# EAGLE design Breakout (EAGLE 6.5.0)
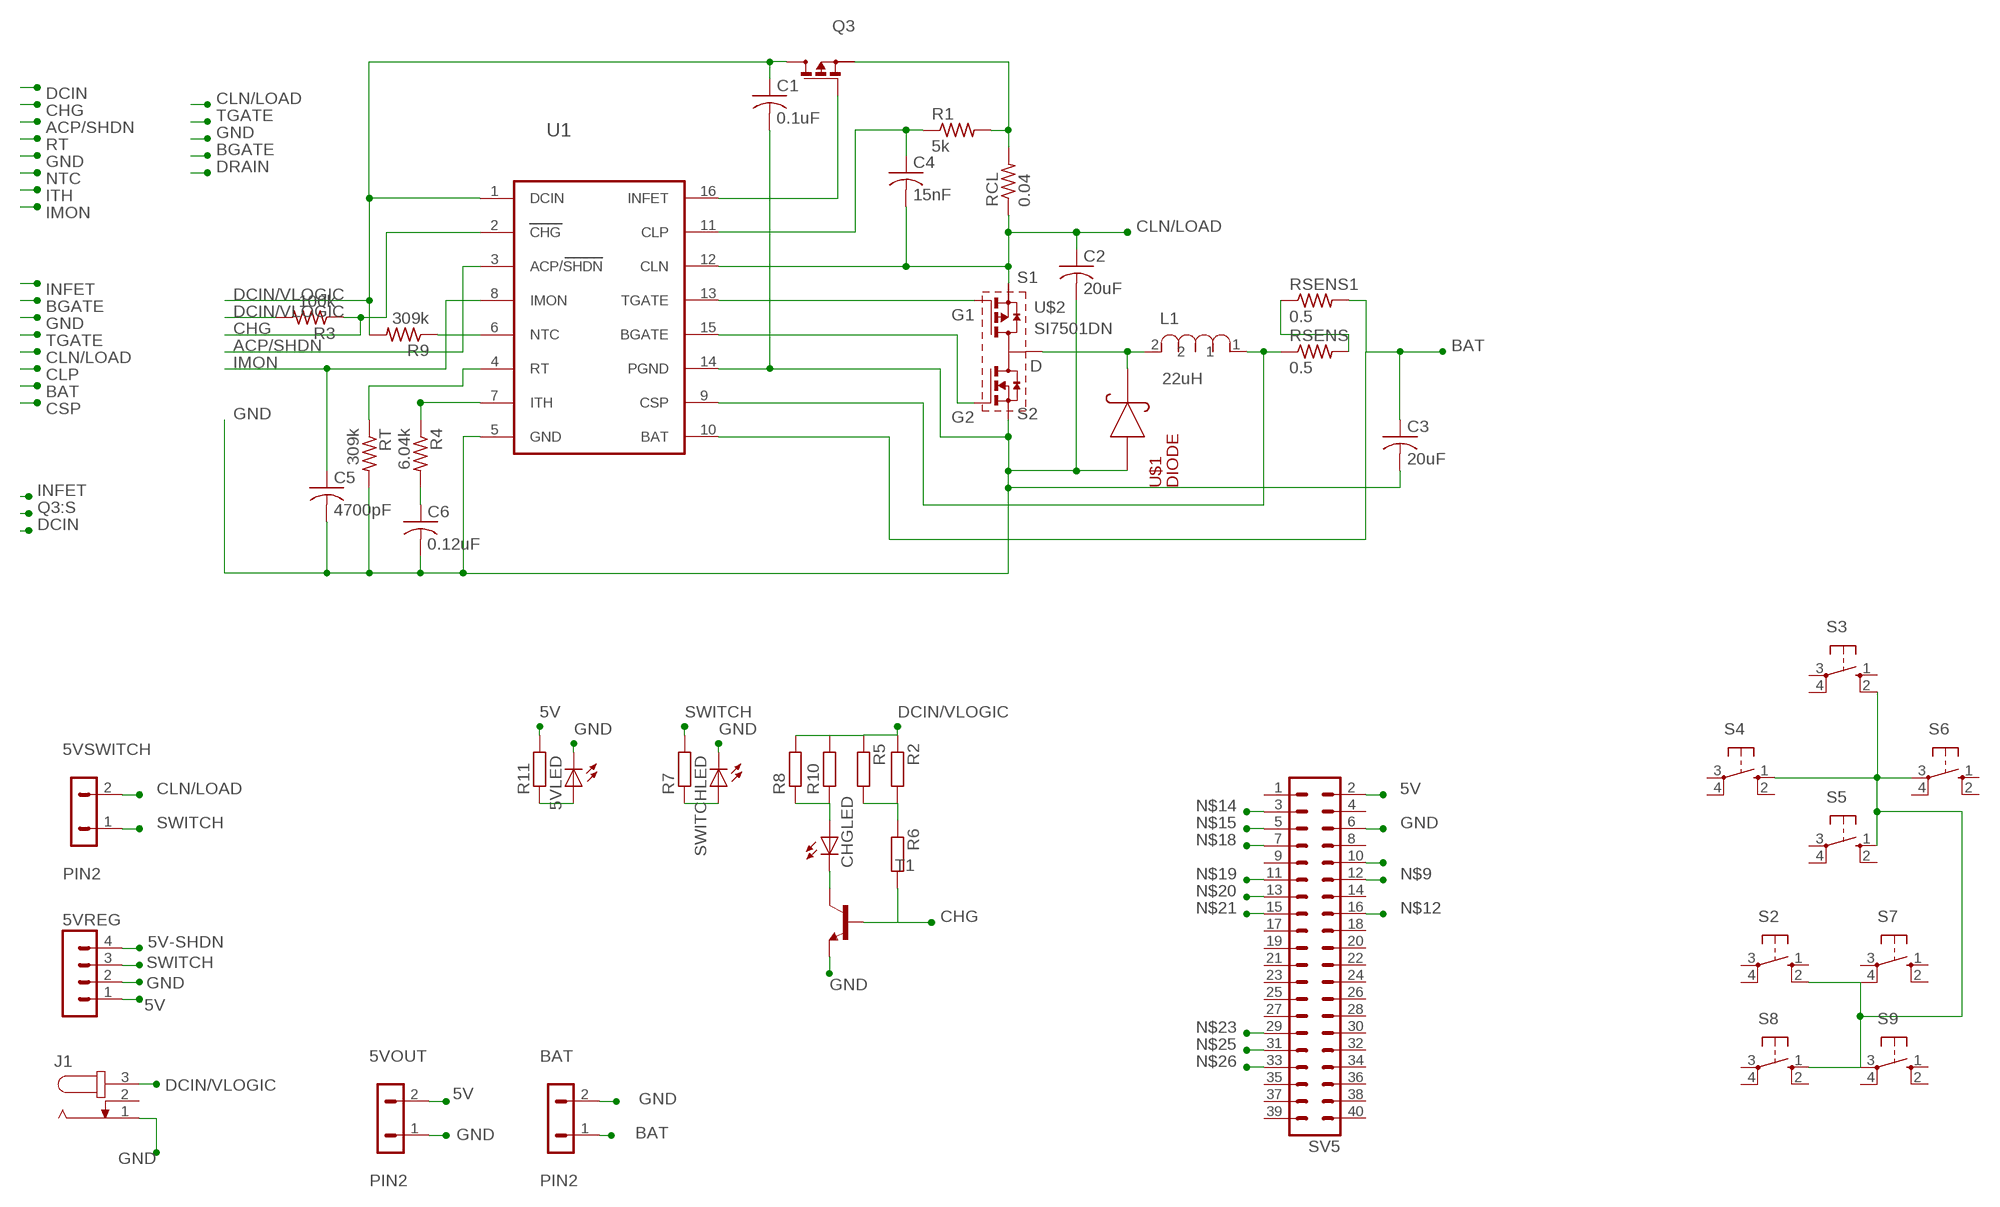
[diagram p0: schematic, sheet 1]

## Parts
5VLED  LED5MM  [LED5MM]
5VOUT  PIN2  [PIN2]
5VREG  MA04-1  [MA04-1]
5VSWITCH  PIN2  [PIN2]
BAT  PIN2  [PIN2]
C1  0.1uF  C-USC1210  [C1210]
C2  20uF  C-USC1210  [C1210]
C3  20uF  C-USC1210  [C1210]
C4  15nF  C-USC1210  [C1210]
C5  4700pF  C-USC1210  [C1210]
C6  0.12uF  C-USC1210  [C1210]
CHGLED  LED5MM  [LED5MM]
J1  JACK-PLUG0  [SPC4077]
L1  22uH  SDR1005INDUCTOR  [POWERINDUCTOR]
Q3  MOSFET  [SOT-23]
R1  5k  R-US_R1206  [R1206]
R2  R-EU_0207/7  [0207/7]
R3  100k  R-US_R1206  [R1206]
R4  6.04k  R-US_R1206  [R1206]
R5  R-EU_0207/7  [0207/7]
R6  R-EU_0207/7  [0207/7]
R7  R-EU_0207/7  [0207/7]
R8  R-EU_0207/7  [0207/7]
R9  309k  R-US_R1206  [R1206]
R10  R-EU_0207/7  [0207/7]
R11  R-EU_0207/7  [0207/7]
RCL  0.04  R-US_R1206  [R1206]
RSENS  0.5  0612/1632  [0612/1632]
RSENS1  0.5  0612/1632  [0612/1632]
RT  309k  R-US_R1206  [R1206]
S2  10-XX  [B3F-10XX]
S3  10-XX  [B3F-10XX]
S4  10-XX  [B3F-10XX]
S5  10-XX  [B3F-10XX]
S6  10-XX  [B3F-10XX]
S7  10-XX  [B3F-10XX]
S8  10-XX  [B3F-10XX]
S9  10-XX  [B3F-10XX]
SV5  MA20-2  [MA20-2]
SWITCHLED  LED5MM  [LED5MM]
T1  -NPN-TO92-E1  [TO92-E1]
U1  LTC6004  [SSOP-16]
U$1  DIODE  [DIODE]
U$2  SI7501DN  [POWERPAK]

## Nets
5V: 5VOUT.2 5VREG.1 R11.2 SV5.2
5V-SHDN: 5VREG.4
ACP/SHDN: U1.3(ACP/SHDN)
BAT: BAT.1 C3.1 RSENS1.2 U1.10(BAT)
BGATE: U1.15(BGATE) U$2.G2
CHG: R3.1 R6.2 T1.2(B) U1.2(CHG)
CLN/LOAD: 5VSWITCH.2 C2.1 C4.2 RCL.1 U1.12(CLN) U$2.S1
CLP: C4.1 R1.1 U1.11(CLP)
CSP: L1.1 RSENS.1 U1.9(CSP)
DCIN/VLOGIC: C1.1 J1.3 Q3.DRAIN(D) R2.1 R3.2 R5.1 R8.2 R9.2 R10.2 U1.1(DCIN)
DRAIN: L1.2 U$1.P$1 U$2.D
GND: 5VLED.K(C) 5VOUT.1 5VREG.2 BAT.2 C1.2 C2.2 C3.2 C5.2 C6.2 J1.1 RT.2 S2.2(S1) S3.2(S1) S4.1(S) S5.1(S) S6.3(P) S7.4(P1) S8.1(S) S9.3(P) SV5.6 SWITCHLED.K(C) T1.3(E) U1.5(GND) U1.14(PGND) U$1.P$2 U$2.S2
IMON: C5.1 U1.8(IMON)
INFET: Q3.GATE(G) U1.16(INFET)
ITH: R4.1 U1.7(ITH)
N$1: RSENS1.1 RSENS.2
N$6: R2.2 R5.2 R6.1
N$9: SV5.12
N$10: CHGLED.A R8.1 R10.1
N$11: C6.1 R4.2
N$12: SV5.16
N$13: R7.1 SWITCHLED.A
N$14: SV5.3
N$15: SV5.5
N$16: CHGLED.K(C) T1.1(C)
N$17: 5VLED.A R11.1
N$18: SV5.7
N$19: SV5.11
N$20: SV5.13
N$21: SV5.15
N$23: SV5.29
N$24: SV5.10
N$25: SV5.31
N$26: SV5.33
NTC: R9.1 U1.6(NTC)
Q3:S: Q3.SOURCE(S) R1.2 RCL.2
RT: RT.1 U1.4(RT)
SWITCH: 5VREG.3 5VSWITCH.1 R7.2
TGATE: U1.13(TGATE) U$2.G1
Unconnected: J1.2 S2.1(S) S2.3(P) S2.4(P1) S3.1(S) S3.3(P) S3.4(P1) S4.2(S1) S4.3(P) S4.4(P1) S5.2(S1) S5.3(P) S5.4(P1) S6.1(S) S6.2(S1) S6.4(P1) S7.1(S) S7.2(S1) S7.3(P) S8.2(S1) S8.3(P) S8.4(P1) S9.1(S) S9.2(S1) S9.4(P1) SV5.1 SV5.4 SV5.8 SV5.9 SV5.14 SV5.17 SV5.18 SV5.19 SV5.20 SV5.21 SV5.22 SV5.23 SV5.24 SV5.25 SV5.26 SV5.27 SV5.28 SV5.30 SV5.32 SV5.34 SV5.35 SV5.36 SV5.37 SV5.38 SV5.39 SV5.40

## Library data of the parts
5VLED CHGLED SWITCHLED = led:LED: LED OSRAM: - CHIPLED LG R971, LG N971, LY N971, LG Q971, LY Q971, LO R971, LY R971 LH N974, LH R974 LS Q976, LO Q976, LY Q976 LO Q996 - Hyper CHIPLED LW Q18S LB Q993, LB Q99A, LB R99A - SideLED LS A670, LO A670, LY A670, LG A670, LP A670 LB A673, LV A673, LT A673, LW A673 LH A674 LY A675 LS A676, LA A676, LO A676, LY A676, LW A676 LS A679, LY A679, LG A679 - Hyper Micro SIDELED® LS Y876, LA Y876, LO Y876, LY Y876 LT Y87S - SmartLED LW L88C, LW L88S LB L89C, LB L89S, LG L890 LS L89K, LO L89K, LY L89K LS L896, LA L896, LO L896, LY L896 - TOPLED LS T670, LO T670, LY T670, LG T670, LP T670 LSG T670, LSP T670, LSY T670, LOP T670, LYG T670 LG T671, LOG T671, LSG T671 LB T673, LV T673, LT T673, LW T673 LH T674 LS T676, LA T676, LO T676, LY T676, LB T676, LH T676, LSB T676, LW T676 LB T67C, LV T67C, LT T67C, LS T67K, LO T67K, LY T67K, LW E67C LS E67B, LA E67B, LO E67B, LY E67B, LB E67C, LV E67C, LT E67C LW T67C LS T679, LY T679, LG T679 LS T770, LO T770, LY T770, LG T770, LP T770 LB T773, LV T773, LT T773, LW T773 LH T774 LS E675, LA E675, LY E675, LS T675 LS T776, LA T776, LO T776, LY T776, LB T776 LHGB T686 LT T68C, LB T68C - Hyper Mini TOPLED® LB M676 - Mini TOPLED Santana® LG M470 LS M47K, LO M47K, LY M47K Source: http://www.osram.convergy.de LUXEON: - LUMILED® LXK2-PW12-R00, LXK2-PW12-S00, LXK2-PW14-U00, LXK2-PW14-V00 LXK2-PM12-R00, LXK2-PM12-S00, LXK2-PM14-U00 LXK2-PE12-Q00, LXK2-PE12-R00, LXK2-PE12-S00, LXK2-PE14-T00, LXK2-PE14-U00 LXK2-PB12-K00, LXK2-PB12-L00, LXK2-PB12-M00, LXK2-PB14-N00, LXK2-PB14-P00, LXK2-PB14-Q00 LXK2-PR12-L00, LXK2-PR12-M00, LXK2-PR14-Q00, LXK2-PR14-R00 LXK2-PD12-Q00, LXK2-PD12-R00, LXK2-PD12-S00 LXK2-PH12-R00, LXK2-PH12-S00 LXK2-PL12-P00, LXK2-PL12-Q00, LXK2-PL12-R00 Source: www.luxeon.com KINGBRIGHT: KA-3528ASYC Source: www.kingbright.com
5VOUT 5VSWITCH BAT = Custom:PIN2
5VREG = con-lstb:MA04-1: PIN HEADER; OC_FARNELL: unknown; OC_NEWARK: unknown
C1-C6 = resistor:C-US: CAPACITOR, American symbol
J1 = con-jack:JACK-PLUG: DC POWER JACK Power Jack, DC, Right Angle, Through Hole, Rated 5A at 16VDC, PC Terminals Distributor: Farnell (www.Farnell.de) Drawing: 84N1161.pdf / 84N1162.pdf Manufacturer: SPC Technology (www.spctechnology.com) Type: SPC4077 / SPC 4078; OC_FARNELL: unknown; OC_NEWARK: unknown
L1 = Custom:SDR1005INDUCTOR
Q3 = Custom:MOSFET
R1 R3 R4 R9 RCL RT = resistor:R-US_: RESISTOR, American symbol
R2 R5-R8 R10 R11 = resistor:R-EU_: RESISTOR, European symbol
RSENS RSENS1 = Custom:0612/1632
S2-S9 = switch-omron:10-XX: OMRON SWITCH; MPN: B3F-1000; OC_FARNELL: 176432; OC_NEWARK: 36M3542
SV5 = con-lstb:MA20-2: PIN HEADER; OC_FARNELL: unknown; OC_NEWARK: unknown
T1 = transistor:*-NPN-: NPN Transistror BF959 corrected 2008.03.06
U1 = Custom:LTC6004
U$1 = Custom:DIODE
U$2 = Custom:SI7501DN

## Board
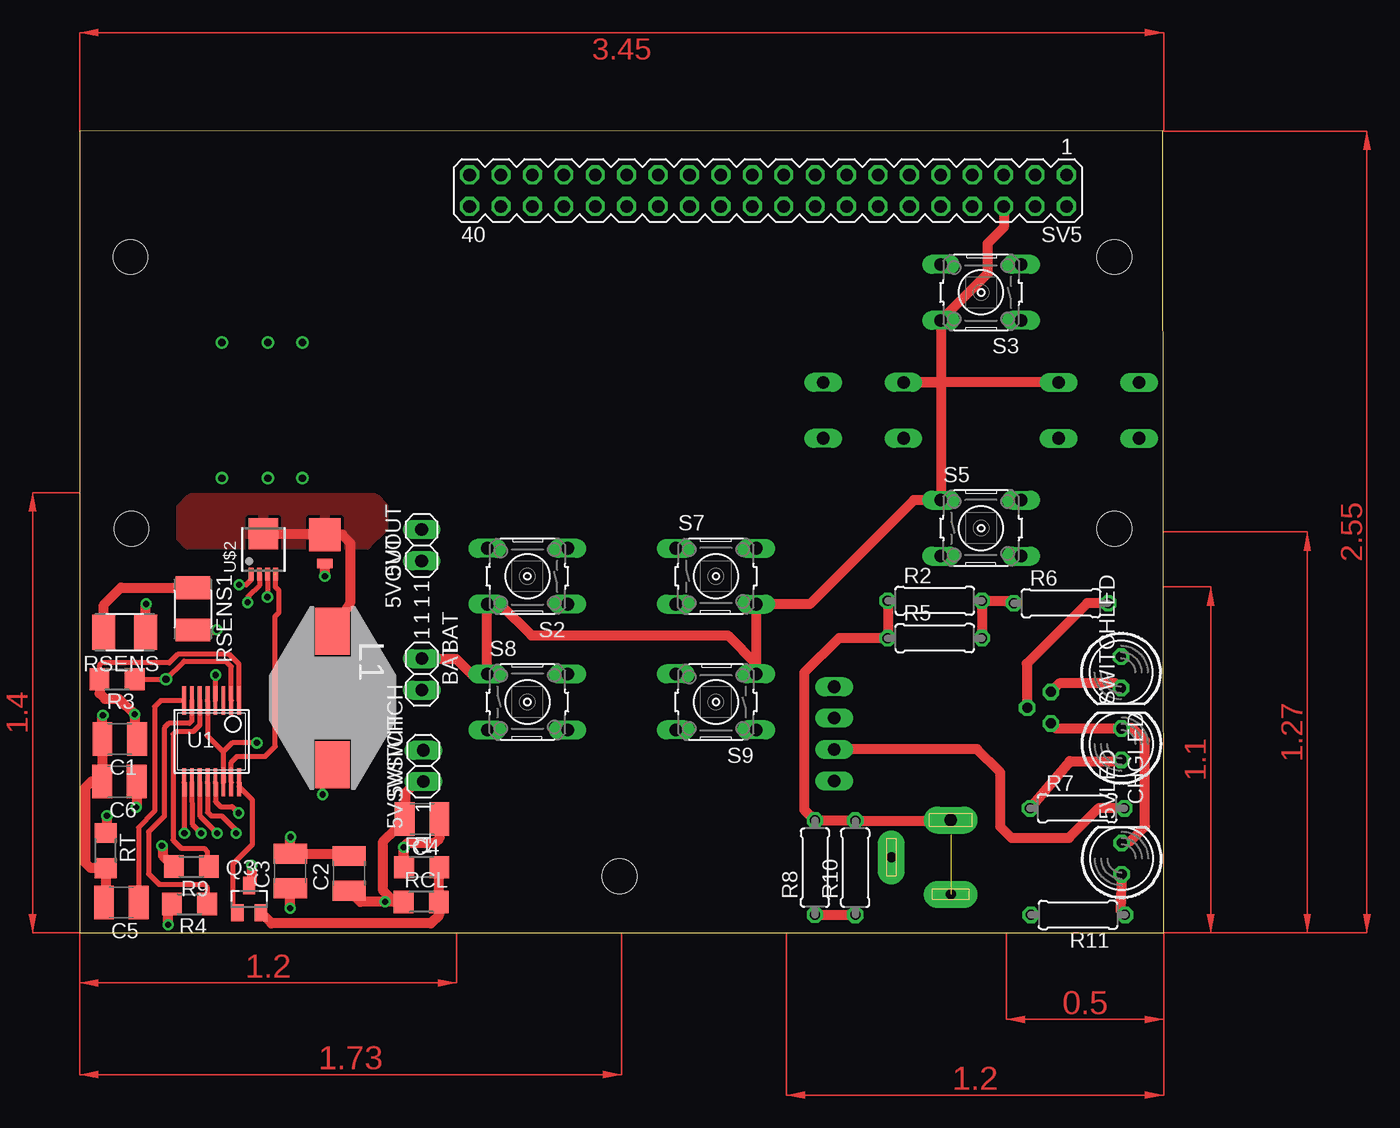
[diagram p1: board, top side]
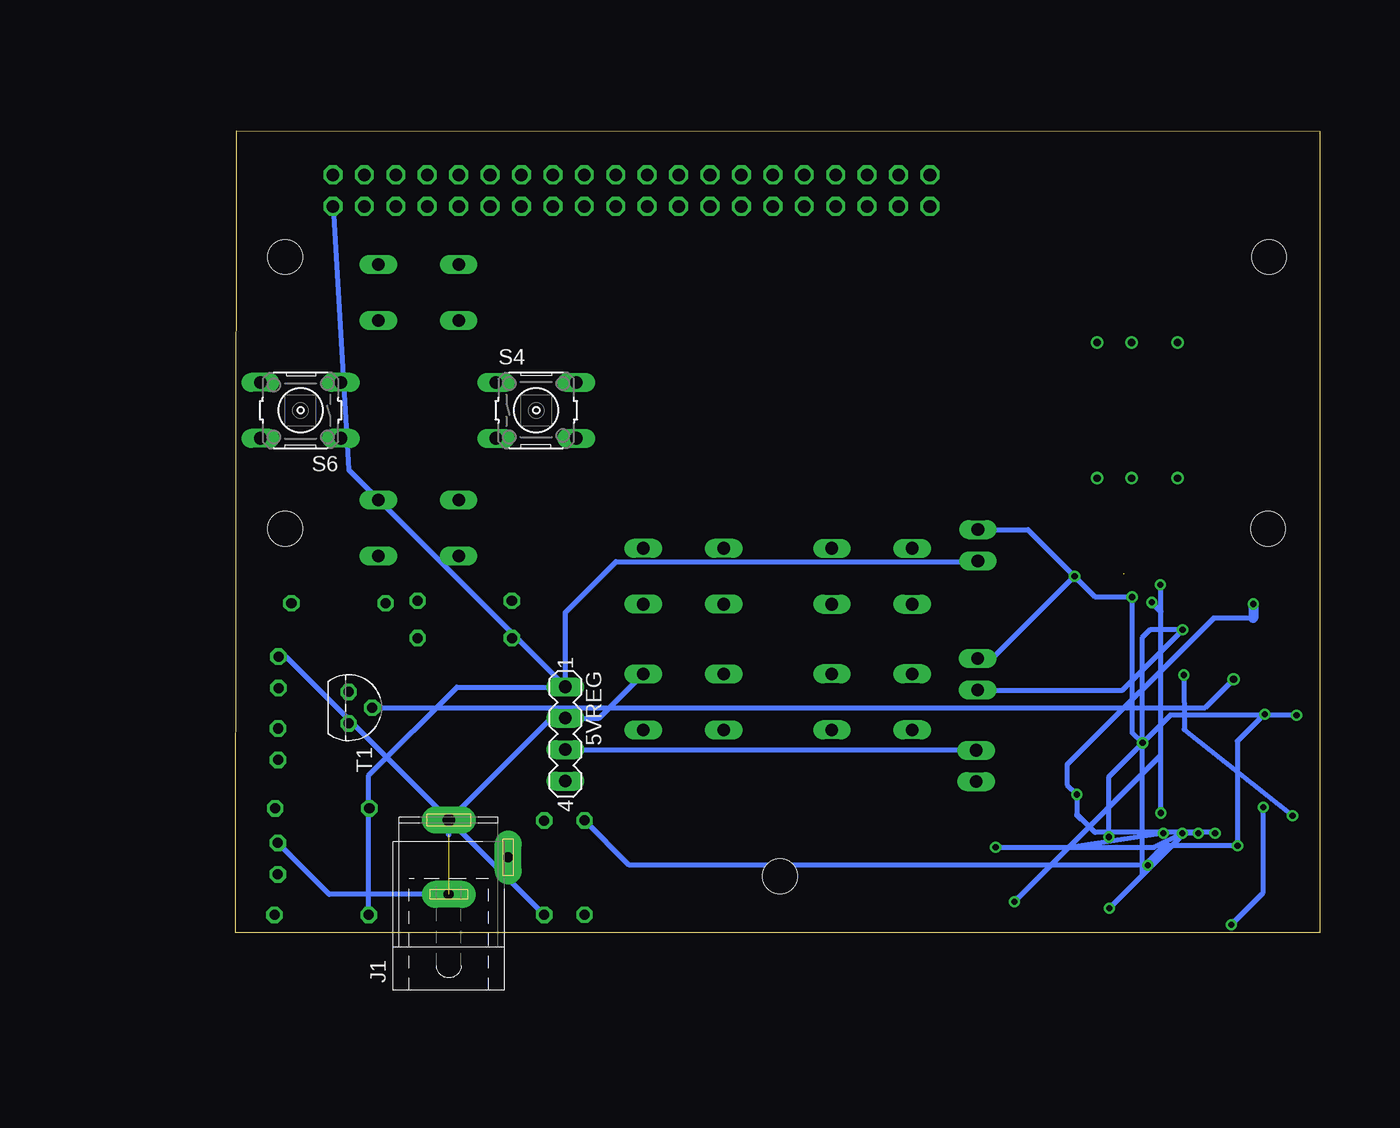
[diagram p2: board, bottom side, seen from below]

Size 87.63 x 64.8 mm. Coordinates in mm from the lower left corner, seen from the top.
Outline: 0,0 87.63,0 87.58,64.8 0,64.77 0,0
Copper layers (1*16): Top 0.035mm / dielectric 1.5mm / Bottom 0.035mm
Design rules "default": minimum track width 10mil, minimum drill 24mil, track to track 8mil, track to pad 8mil, pad to pad 8mil, via to via 8mil, smd to smd 8mil, copper to edge 40mil, drill to drill 8mil, minimum pad ring 10mil, minimum via ring 8mil, stop-mask expansion 4mil, vias tented up to drill 0mil, thermal gap 10mil
Holes 2.79 mm at 4.18,32.64 83.64,32.64 43.65,4.56 4.1,54.61 83.64,54.61

### Footprints (pad centres in the part's own frame; a part is rotated, then mirrored left to right if it is on the bottom)
LED5MM = drill 0.813 octagon: A -1.27,0; K 1.27,0
PIN2 = drill 1.016 long: 1 1.27,0; 2 -1.27,0
MA04-1 = drill 1.016 long: 1 -3.81,0; 2 -1.27,0; 3 1.27,0; 4 3.81,0
C1210 = smd 1.6 x 2.7: 1 -1.4,0; 2 1.4,0
SPC4077 = drill 0.8 pad 2.184 long: 1 -3,0; 2 0,-4.8 | drill 1 pad 2.184 long: 3 3,0
POWERINDUCTOR = smd 3.81 x 2.794: 1 5.397,0; 2 -5.397,0
SOT-23 = smd 1 x 1.4: DRAIN 0,1.1; GATE -0.95,-1.1; SOURCE 0.95,-1.1
R1206 = smd 1.6 x 1.803: 1 -1.422,0; 2 1.422,0
0207/7 = drill 0.813 octagon: 1 -3.81,0; 2 3.81,0
0612/1632 = smd 1.84 x 2.8: 1 -1.7,0; 2 1.7,0
B3F-10XX = drill 1.016 long: 1 -3.251,2.261; 2 3.251,2.261; 3 -3.251,-2.261; 4 3.251,-2.261
MA20-2 = drill 1.016 octagon: 1 -24.13,-1.27; 2 -24.13,1.27; 3 -21.59,-1.27; 4 -21.59,1.27; 5 -19.05,-1.27; 6 -19.05,1.27; 7 -16.51,-1.27; 8 -16.51,1.27; 9 -13.97,-1.27; 10 -13.97,1.27; 11 -11.43,-1.27; 12 -11.43,1.27; 13 -8.89,-1.27; 14 -8.89,1.27; 15 -6.35,-1.27; 16 -6.35,1.27; 17 -3.81,-1.27; 18 -3.81,1.27; 19 -1.27,-1.27; 20 -1.27,1.27; 21 1.27,-1.27; 22 1.27,1.27; 23 3.81,-1.27; 24 3.81,1.27; 25 6.35,-1.27; 26 6.35,1.27; 27 8.89,-1.27; 28 8.89,1.27; 29 11.43,-1.27; 30 11.43,1.27; 31 13.97,-1.27; 32 13.97,1.27; 33 16.51,-1.27; 34 16.51,1.27; 35 19.05,-1.27; 36 19.05,1.27; 37 21.59,-1.27; 38 21.59,1.27; 39 24.13,-1.27; 40 24.13,1.27
TO92-E1 = drill 0.813 octagon: 1 -1.27,0; 2 0,1.905; 3 1.27,0
SSOP-16 = smd 2.286 x 0.305: 1 -3.302,2.349; 2 -3.302,1.714; 3 -3.302,1.079; 4 -3.302,0.444; 5 -3.302,-0.191; 6 -3.302,-0.826; 7 -3.302,-1.461; 8 -3.302,-2.096; 9 3.302,-2.096; 10 3.302,-1.461; 11 3.302,-0.826; 12 3.302,-0.191; 13 3.302,0.444; 14 3.302,1.079; 15 3.302,1.714; 16 3.302,2.349
DIODE = smd 2.667 x 2.54: P$1 -1.638,0 | smd 0.762 x 1.27: P$2 0.699,0
POWERPAK = smd 2.4 x 2.54: D 0,1.27 | smd 0.4 x 1.016: G1 -0.325,-1.976; G2 0.975,-1.976; S1 -0.975,-1.976; S2 0.325,-1.976

### Placement (x,y rotation side)
5VLED  84.24,5.99 90 top
5VOUT  27.64,31.31 90 top
5VREG  60.98,16.07 270 bottom
5VSWITCH  27.77,13.47 90 top
BAT  27.66,20.88 270 top
C1  3.24,15.66 180 top
C2  21.79,4.79 90 top
C3  17.02,4.99 90 top
C4  27.68,9.19 180 top
C5  3.37,2.44 180 top
C6  3.22,12.2 180 top
CHGLED  84.19,21.04 270 top
J1  70.42,6.09 90 bottom
L1  20.44,18.97 270 top
Q3  13.71,2.71 0 top
R1  27.65,5.29 0 top
R2  69.13,26.83 0 top
R3  3.03,20.48 180 top
R4  8.88,2.31 180 top
R5  69.13,23.81 0 top
R6  79.33,26.63 0 top
R7  80.65,10.05 0 top
R8  59.45,5.26 90 top
R9  9.04,5.34 180 top
R10  62.7,5.25 90 top
R11  80.7,1.44 180 top
RCL  27.62,2.49 0 top
RSENS  3.65,24.28 180 top
RSENS1  9.15,26.17 270 top
RT  2.1,6.64 270 top
S2  36.2,28.81 180 top
S3  72.87,51.74 180 top
S4  63.35,42.22 0 bottom
S5  72.87,32.69 0 top
S6  82.4,42.22 180 bottom
S7  51.44,28.81 0 top
S8  36.2,18.65 0 top
S9  51.44,18.65 180 top
SV5  55.65,59.97 180 top
SWITCHLED  84.22,15.23 90 top
T1  78.51,18.19 270 bottom
U1  10.54,15.45 270 top
U$1  19.83,30.53 270 top
U$2  14.86,30.97 0 top

### Tracks (layer width: path | path; a pad name or v marks a point on that pad's centre or on a via)
5V
  Bottom 0.406: R11.2 76.89,12.71 69.76,19.84 61.02,19.84 5VREG.1 | 5VREG.1 60.98,25.91 56.9,29.99 27.69,29.99 5VOUT.2 | SV5.2 78.51,37.4 5VREG.1
BAT  (via drill 0.5)
  Top 0.406: U1.10 9.11,8.88 9.11,8.77 v9.83,8.04
  Top 0.813: v17.02,1.98 C3.1 | RSENS1.2 v11.08,24.47 v11.09,24.47
  Bottom 0.406: BAT.1 15.96,19.61 v11.09,24.47 13.73,24.47 14.38,23.82 14.38,4.62 v17.02,1.98 10.96,8.04 v9.83,8.04
BGATE  (1 unrouted)
  Top 0.406: U1.15 12.25,13.77 12.73,14.25 15,14.25 15.81,15.06 15.76,15.11 15.76,25.54 16.1,25.87 16.1,27.66 15.81,27.95 15.81,28.97
CHG  (via drill 0.6 pad 0.81)
  Top 0.406: R3.1 v6.97,20.48 8.43,21.94 11.8,21.94 12.25,21.49 U1.2
  Top 0.813: R6.2 81.46,26.63 76.57,21.74 76.57,18.22 T1.2
  Bottom 0.406: T1.2 9.27,18.18 v6.97,20.48
CLN/LOAD  (via drill 0.5)
  Top 0.406: U$2.S1 13.88,28.53 13.47,28.12 v12.89,28.12 | U1.12 10.35,9.73 10.64,9.44 11.5,9.44 12.65,8.29 v12.65,8.04
  Top 0.813: C2.1 22.69,2.49 v24.69,2.49 RCL.1 25.43,2.49 24.54,3.38 24.54,7.38 25.48,8.33 26.23,8.33 C4.2 26.3,9.21 26.3,11.25 27.25,12.2 5VSWITCH.2
  Bottom 0.406: v12.65,8.04 20.31,6.87 v24.69,2.49 12.89,14.29 v12.89,28.12
CLP  (via drill 0.5)
  Top 0.406: U1.11 9.73,12.13 9.73,9.43 v11.12,8.04
  Top 0.813: C4.1 29.08,7.65 28.65,7.22 26.46,7.22 26.16,6.92 26.16,5.36 R1.1 26.23,6.88 v26.22,6.9
  Bottom 0.406: v26.22,6.9 13.42,6.9 v11.12,8.04
CSP  (via drill 0.5)
  Top 0.406: U1.9 8.44,8.21 v8.46,8.04 | v19.64,11.17 19.64,13.61 L1.1
  Top 0.813: RSENS.1 5.35,26.52 v5.38,26.56
  Bottom 0.406: 19.64,9.57 v19.64,11.17 20.44,11.97 L1.1 8.59,25.43 5.38,25.43 | 19.64,9.57 19.64,9.47 19.36,9.19 | v8.46,8.04 8.54,8.11 18.19,8.11 19.64,9.57
  Bottom 0.813: v5.38,26.56 5.38,25.43
DCIN/VLOGIC  (via drill 0.5)
  Top 0.406: U1.1 12.88,21.7 12.08,22.5 7.93,22.5 7.25,21.81 1.8,21.81 1.59,21.59 1.59,20.5 R3.2 | 4.41,15.88 C1.1
  Top 0.813: 13.65,3.81 Q3.DRAIN 13.91,4.02 v13.91,5.46 | 7.48,5.39 R9.2 6.73,6.22 6.73,6.94 v6.66,7.02 | R2.1 R5.1 | R5.1 | 59.21,9.31 R8.2 | R8.2 R10.2 70.39,9.06 J1.3 | R5.1 61.4,23.81 58.57,20.99 58.57,9.95 R8.2 | R3.2 1.61,19.33 2.05,18.89 3.17,18.89 v4.45,17.66 4.45,15.85 C1.1
  Bottom 0.406: v4.45,17.66 4.5,17.67 6.69,15.48 6.69,7.06 v6.66,7.02 12.35,7.02 12.4,6.98 | v13.91,5.46 55.84,5.46 R8.2
  Bottom 0.813: 12.4,6.98 v13.91,5.46
DRAIN
  Top 0.813: U$2.D 19.75,32.24 U$1.P$1 21.23,32.16 21.86,31.53 21.86,26.62 L1.2
  pour Top: 15.61,31.37 23.21,31.37 24.58,32.74 24.58,34.38 23.87,35.09 8.98,35.09 8.19,34.3 8.19,31.95 8.75,31.39
GND  (via drill 0.5)  (1 unrouted)
  Top 0.406: U1.5 10.35,15.87 11.61,14.61 | 11.61,14.61 U1.14 | U$2.S2 v15.18,27.12 | v14.33,15.34 12.34,15.34 11.61,14.61
  Top 0.813: C5.2 2.12,2.59 RT.2 2.06,5.26 0.84,5.26 0.45,5.65 0.45,11.72 0.94,12.2 C6.2 1.84,12.22 C1.2 1.84,17.54 v1.88,17.57 | v19.83,28.82 U$1.P$2 | C2.2 21.59,6.39 C3.2 17.02,7.71 v17.05,7.74 | 5VLED.K 84.97,7.42 86.12,8.57 86.12,15.54 85.14,16.52 84.24,16.52 SWITCHLED.K 78.92,16.5 T1.3 | 69.62,44.38 S3.2 73.43,53.29 73.38,53.33 73.38,55.69 74.7,57 SV5.6 | 69.62,44.38 S5.1 67.44,34.95 59.03,26.54 S7.4 54.69,21.75 | S6.3 S4.1 69.53,44.48 69.62,44.38 | 54.69,21.75 S9.3 | BAT.2 27.7,22.11 30.46,22.11 31.66,20.91 S8.1 S2.2 33.99,26.55 36.51,24.02 52.41,24.02 54.69,21.75
  Bottom 0.406: v15.18,27.12 18.13,27.12 v19.83,28.82 | v17.05,7.74 17.05,12.62 v14.33,15.34 | v1.88,17.57 12.09,17.57 v14.33,15.34 | v15.18,27.12 15.18,16.19 v14.33,15.34 | 5VOUT.1 23.59,32.58 v19.83,28.82 | BAT.2 26.49,22.15 v19.83,28.82 | J1.1 80.08,3.09 5VLED.K | 70.42,7.9 70.45,7.94 70.45,9.05 62.16,17.34 5VREG.2 58.26,17.34 S9.3
  other vias: 15.17,27.12
IMON
  Top 0.406: U1.8 6.54,18.76 6.05,18.27 6.05,9.8 4.76,8.5 4.76,2.45 C5.1
INFET
  Top 0.406: Q3.GATE 12.38,1.99 12.38,5.54 13.95,7.12 13.95,10.74 12.88,11.81 U1.16
ITH
  Top 0.406: U1.7 9.07,17.13 8.86,16.92 7.2,16.92 6.85,16.56 6.85,9.41 5.58,8.14 5.58,4.75 6.42,3.91 10.09,3.91 10.31,3.69 10.29,3.19 R4.1
N$1
  Top 0.813: RSENS.2 1.95,26.5 3.33,27.88 9.14,27.88 RSENS1.1
N$2  (via drill 0.6 pad 0.81)
  other vias: 11.51,36.73
N$3  (via drill 0.6 pad 0.81)
  other vias: 15.21,36.73
N$4  (via drill 0.6 pad 0.81)
  other vias: 18.01,36.73
N$5  (via drill 0.6 pad 0.81)
  other vias: 11.51,47.7
N$6
  Top 0.813: R6.1 75.32,26.83 R2.2 R5.2
N$7  (via drill 0.6 pad 0.81)
  other vias: 15.21,47.7
N$8  (via drill 0.6 pad 0.81)
  other vias: 18.01,47.7
N$10
  Top 0.813: R8.1 62.69,1.45 R10.1
  Bottom 0.406: CHGLED.A 83.57,22.31 R10.1
N$11  (via drill 0.5)
  Top 0.813: C6.1 4.62,10.19 v4.58,10.15 | v7.17,0.65 7.17,2.02 R4.2
  Bottom 0.406: v7.17,0.65 4.58,3.23 v4.58,10.15
N$13
  Top 0.813: SWITCHLED.A 84.13,13.87 80.05,13.87 R7.1
N$16
  Top 0.813: CHGLED.K 83.98,19.97 83.92,19.97 83.75,20.14 79.2,20.14 T1.1
N$17
  Top 0.813: 5VLED.A 84.14,1.8 R11.1
NTC
  Top 0.406: U1.6 9.71,16.78 9.18,16.26 7.75,16.26 7.54,16.05 7.54,7.47 8.21,6.81 10.08,6.81 10.33,6.56 10.33,5.47 R9.1
Q3:S
  Top 0.813: R1.2 29.04,5.26 RCL.2 29.04,1.4 28.39,0.75 15.52,0.75 Q3.SOURCE
RT  (via drill 0.5)
  Top 0.406: U1.4 10.98,21.08 v10.99,20.82
  Top 0.813: v2.2,9.46 2.14,8.1 RT.1
  Bottom 0.406: v10.99,20.82 10.97,16.41 v2.2,9.46
SWITCH
  Top 0.813: R7.2 84.42,10.09 82.41,10.09 79.98,7.66 75.34,7.66 74.43,8.57 74.43,12.95 72.55,14.84 61.02,14.84 5VREG.3
  Bottom 0.406: 5VREG.3 27.83,14.79 5VSWITCH.1
TGATE  (via drill 0.5)
  Top 0.406: U$2.G1 14.53,28.05 13.67,27.18 | 13.67,27.18 13.67,26.78 v13.58,26.69 13.58,27.1 13.67,27.18 | U1.13 10.98,10.6 11.38,10.2 12.32,10.2 v12.85,9.67
  Bottom 0.406: v12.85,9.67 12.85,25.95 v13.58,26.69
(copper drawn outside any net)
  shapes: Top area x9